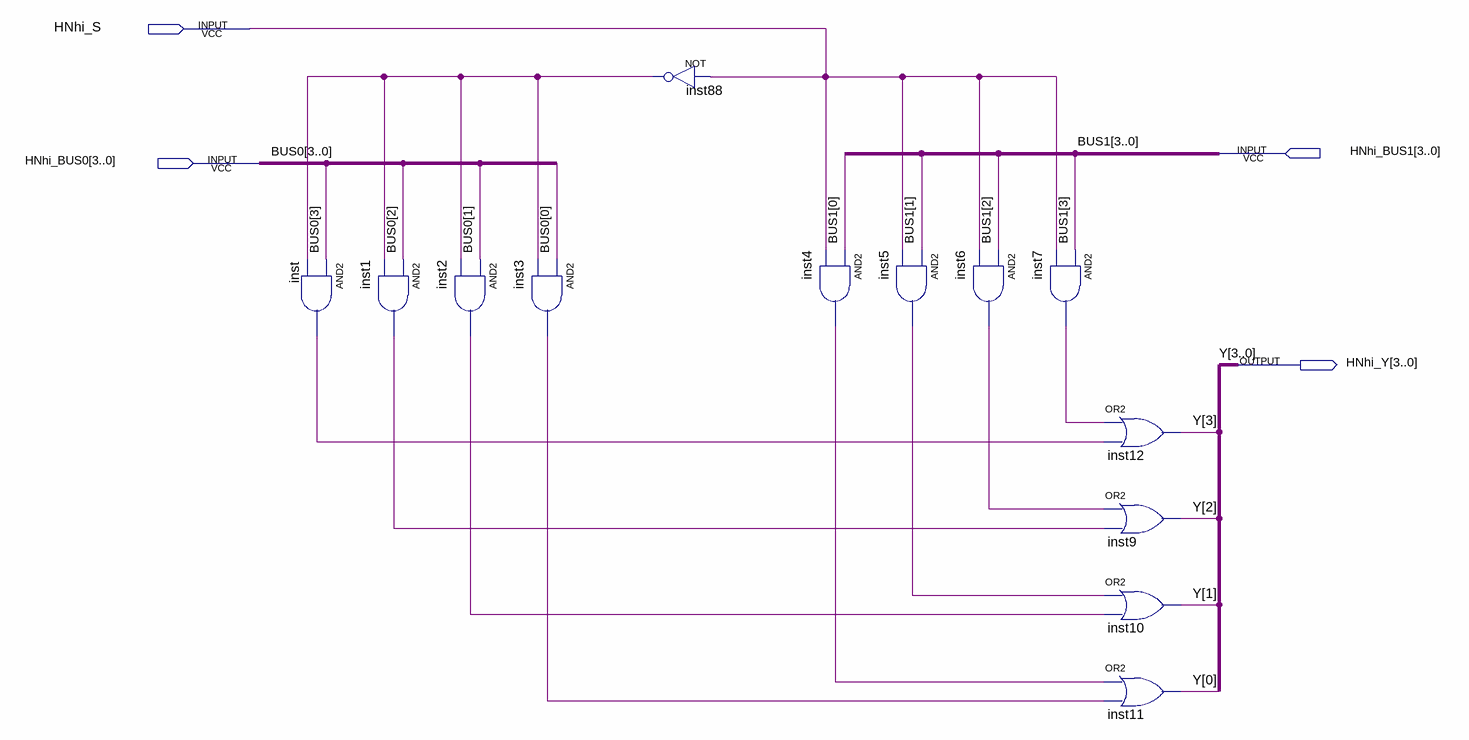
[diagram p0: schematic sheet]
// Quartus schematic mux21_4.bdf as structural Verilog: 13 symbols, 4 pins
module mux21_4 (
  input  HNhi_S,
  input  [3:0] HNhi_BUS1,
  input  [3:0] HNhi_BUS0,
  output [3:0] HNhi_Y
);

  wire inst1_out, inst2_out, inst3_out, inst4_out, inst5_out, inst6_out, inst7_out, inst88_out, inst_out;

  and inst (inst_out, HNhi_BUS0[3], inst88_out);
  and inst1 (inst1_out, HNhi_BUS0[2], inst88_out);
  and inst2 (inst2_out, HNhi_BUS0[1], inst88_out);
  and inst3 (inst3_out, HNhi_BUS0[0], inst88_out);
  not inst88 (inst88_out, HNhi_S);
  and inst4 (inst4_out, HNhi_BUS1[0], HNhi_S);
  and inst5 (inst5_out, HNhi_BUS1[1], HNhi_S);
  and inst6 (inst6_out, HNhi_BUS1[2], HNhi_S);
  and inst7 (inst7_out, HNhi_BUS1[3], HNhi_S);
  or inst12 (HNhi_Y[3], inst7_out, inst_out);
  or inst9 (HNhi_Y[2], inst6_out, inst1_out);
  or inst10 (HNhi_Y[1], inst5_out, inst2_out);
  or inst11 (HNhi_Y[0], inst4_out, inst3_out);

  // Other names for the same wires on the sheet: BUS0[3:0] = HNhi_BUS0; BUS1[3:0] = HNhi_BUS1; Y[3:0] = HNhi_Y
endmodule
